# Altium project LimeSDR-XTRX_1v4.PrjPcb (part 8 of 8)
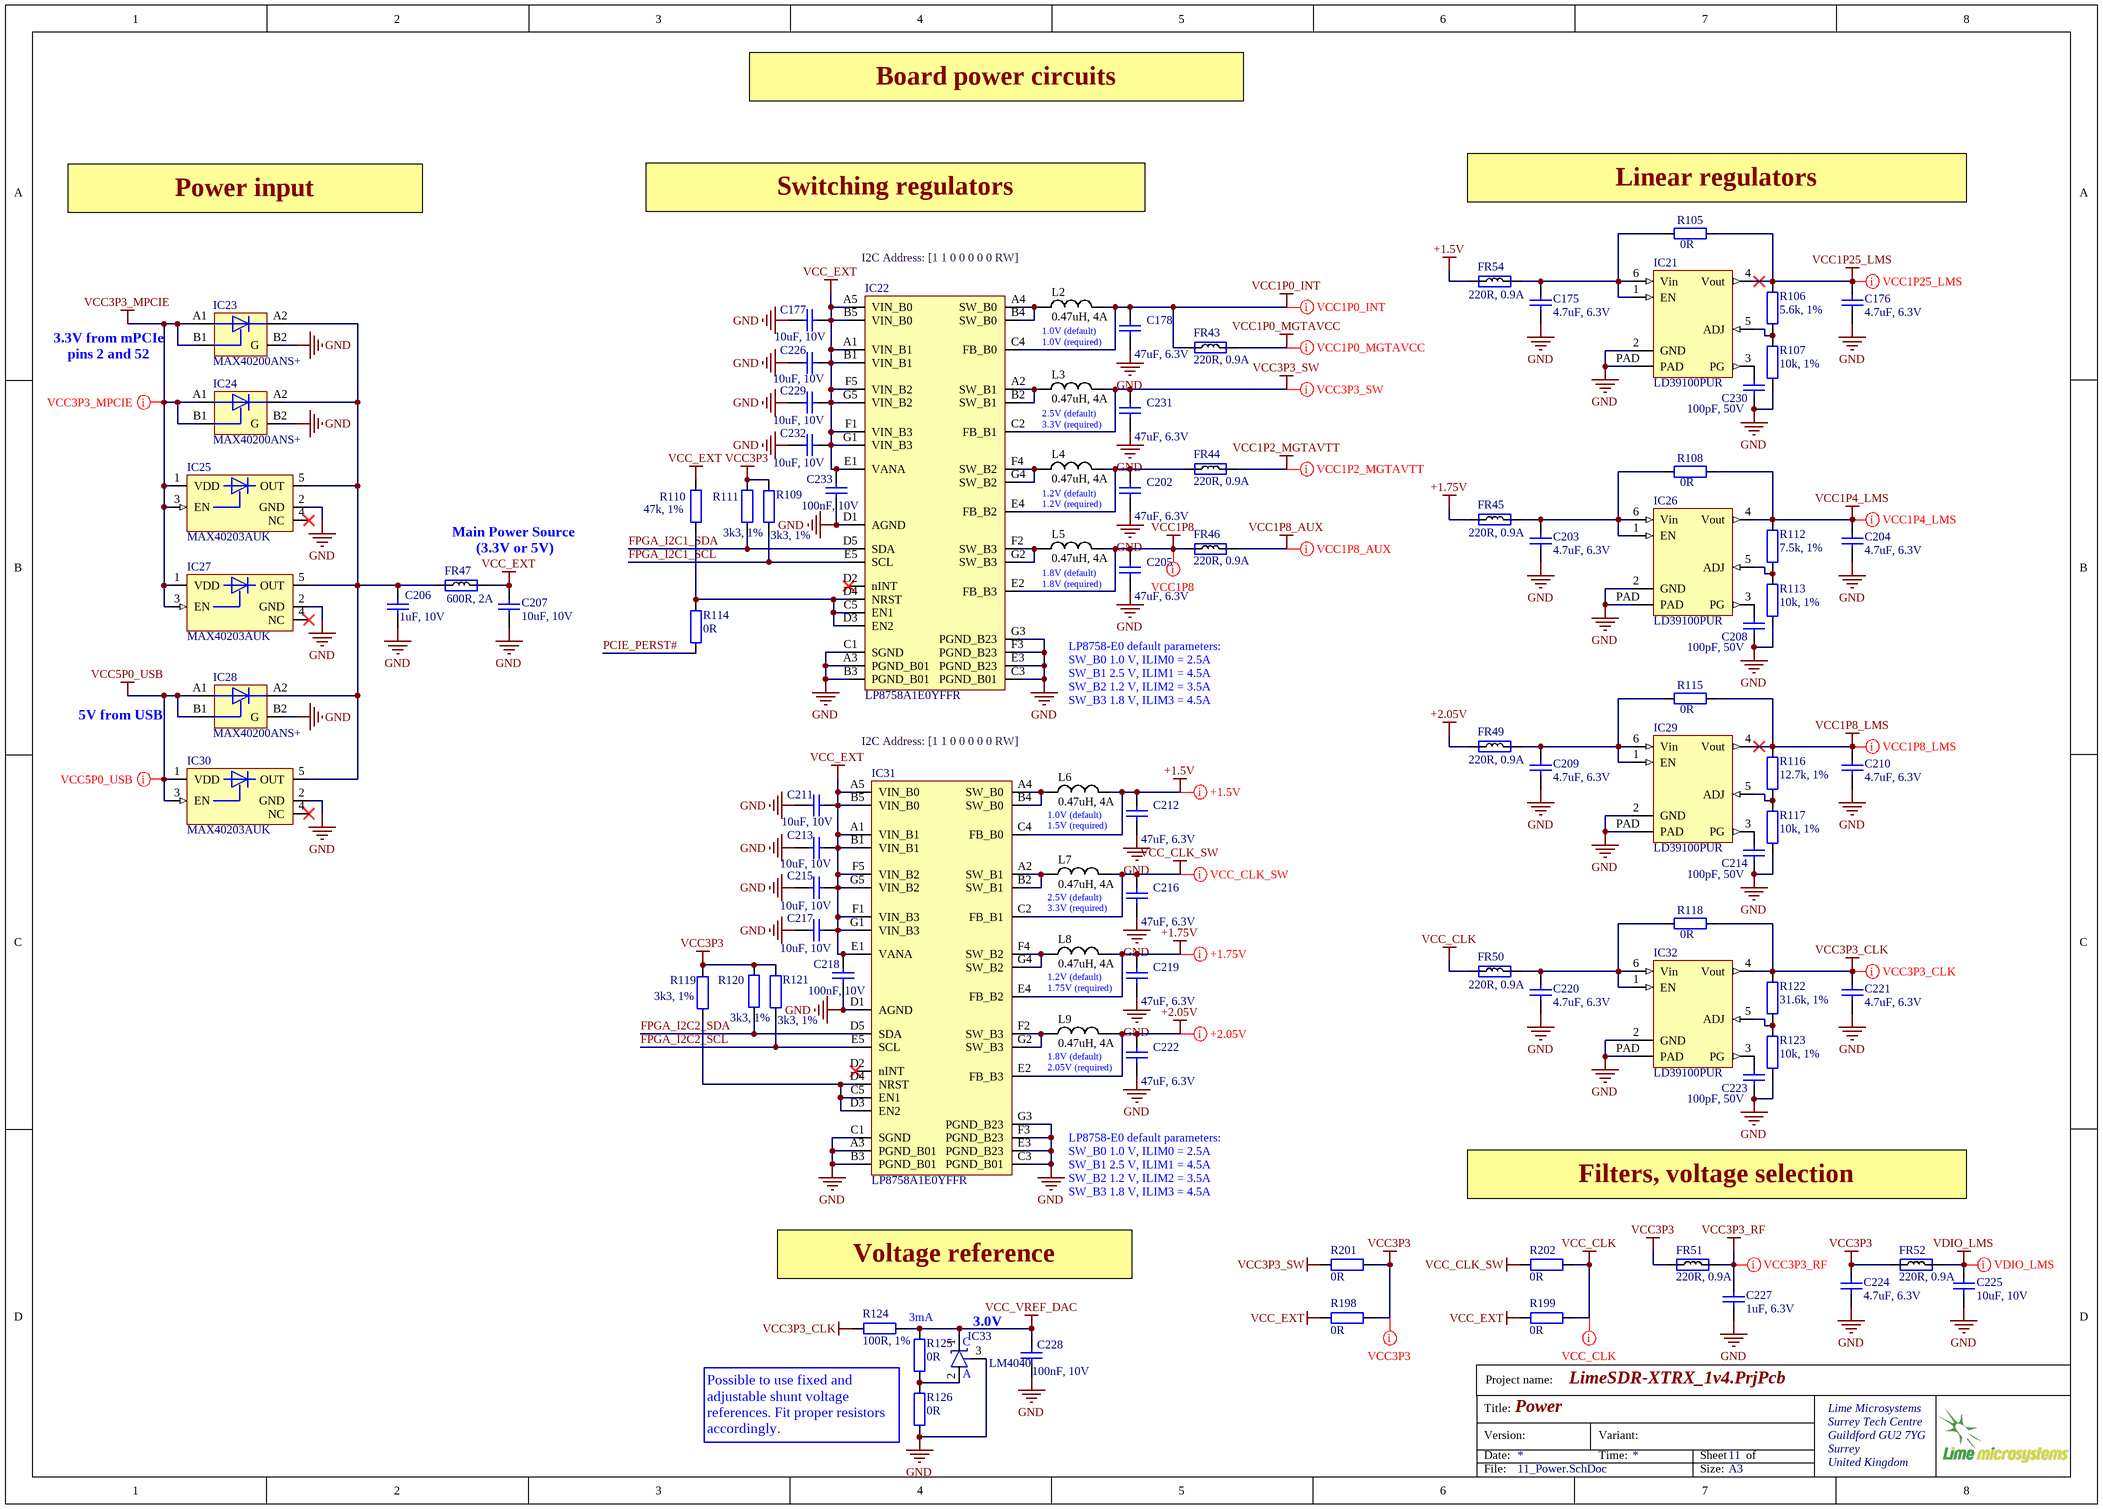
[diagram p13: 11_Power.SchDoc]

## Assembly variants
Default: not fitted C157 C174 C185 C208 C214 C223 C228 C230 ESD1 ESD2 ESD3 ESD4 ESD5 FR55 IC2 IC13 IC25 IC27 IC30 IC32 MN7 MN8 MN9 MN10 MN23 MN25 MN31 MN32 MN33 MN34 MN39 MN40 MN41 MN42 MN53 MN54 R52 R54 R55 R67 R69 R70 R73 R81 R105 R108 R114 R115 R122 R123 R125 R148 R152 R152 R156 R198 R199 X9